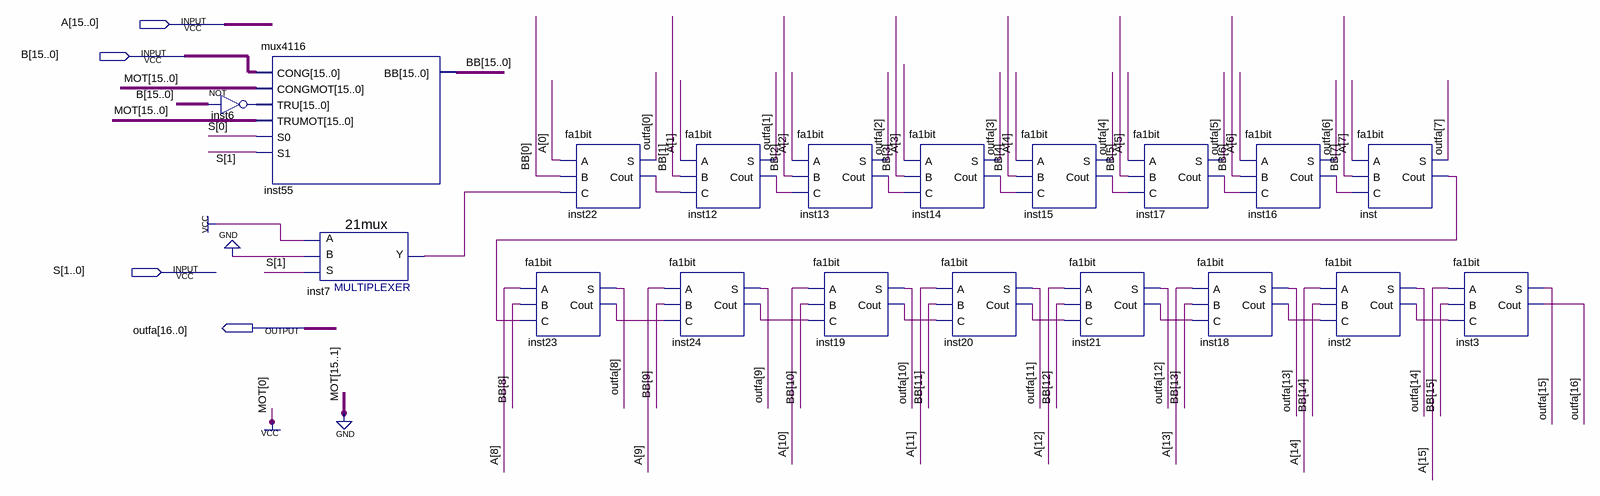
[diagram p0: schematic sheet]
// Quartus schematic lab3.bdf as structural Verilog: 19 symbols, 4 pins
module lab3 (
  input  [15:0] A,
  input  [15:0] B,
  input  [1:0] S,
  output [16:0] outfa
);

  wire inst2_cout, inst7_y, inst12_cout, inst13_cout, inst14_cout, inst15_cout, inst16_cout, inst17_cout,
       inst18_cout, inst19_cout, inst20_cout, inst21_cout, inst22_cout, inst23_cout, inst24_cout, inst_cout;
  wire [15:0] BB, inst6_out;

  assign inst6_out = ~B;  // NOT inst6, 16 bits wide
  mux4116 inst55 (
    .CONG(B), .CONGMOT(16'b0000000000000001), .TRU(inst6_out), .TRUMOT(16'b0000000000000001), .S0(S[0]),
    .S1(S[1]), .BB(BB));
  \21mux  inst7 (.S(S[1]), .B(1'b0), .A(1'b1), .Y(inst7_y));
  fa1bit inst22 (.A(A[0]), .B(BB[0]), .C(inst7_y), .S(outfa[0]), .Cout(inst22_cout));
  fa1bit inst23 (.A(A[8]), .B(BB[8]), .C(inst_cout), .S(outfa[8]), .Cout(inst23_cout));
  fa1bit inst12 (.A(A[1]), .B(BB[1]), .C(inst22_cout), .S(outfa[1]), .Cout(inst12_cout));
  fa1bit inst24 (.A(A[9]), .B(BB[9]), .C(inst23_cout), .S(outfa[9]), .Cout(inst24_cout));
  fa1bit inst13 (.A(A[2]), .B(BB[2]), .C(inst12_cout), .S(outfa[2]), .Cout(inst13_cout));
  fa1bit inst19 (.A(A[10]), .B(BB[10]), .C(inst24_cout), .S(outfa[10]), .Cout(inst19_cout));
  fa1bit inst14 (.A(A[3]), .B(BB[3]), .C(inst13_cout), .S(outfa[3]), .Cout(inst14_cout));
  fa1bit inst20 (.A(A[11]), .B(BB[11]), .C(inst19_cout), .S(outfa[11]), .Cout(inst20_cout));
  fa1bit inst15 (.A(A[4]), .B(BB[4]), .C(inst14_cout), .S(outfa[4]), .Cout(inst15_cout));
  fa1bit inst21 (.A(A[12]), .B(BB[12]), .C(inst20_cout), .S(outfa[12]), .Cout(inst21_cout));
  fa1bit inst17 (.A(A[5]), .B(BB[5]), .C(inst15_cout), .S(outfa[5]), .Cout(inst17_cout));
  fa1bit inst18 (.A(A[13]), .B(BB[13]), .C(inst21_cout), .S(outfa[13]), .Cout(inst18_cout));
  fa1bit inst16 (.A(A[6]), .B(BB[6]), .C(inst17_cout), .S(outfa[6]), .Cout(inst16_cout));
  fa1bit inst2 (.A(A[14]), .B(BB[14]), .C(inst18_cout), .S(outfa[14]), .Cout(inst2_cout));
  fa1bit inst (.A(A[7]), .B(BB[7]), .C(inst16_cout), .S(outfa[7]), .Cout(inst_cout));
  fa1bit inst3 (.A(A[15]), .B(BB[15]), .C(inst2_cout), .S(outfa[15]), .Cout(outfa[16]));
endmodule
